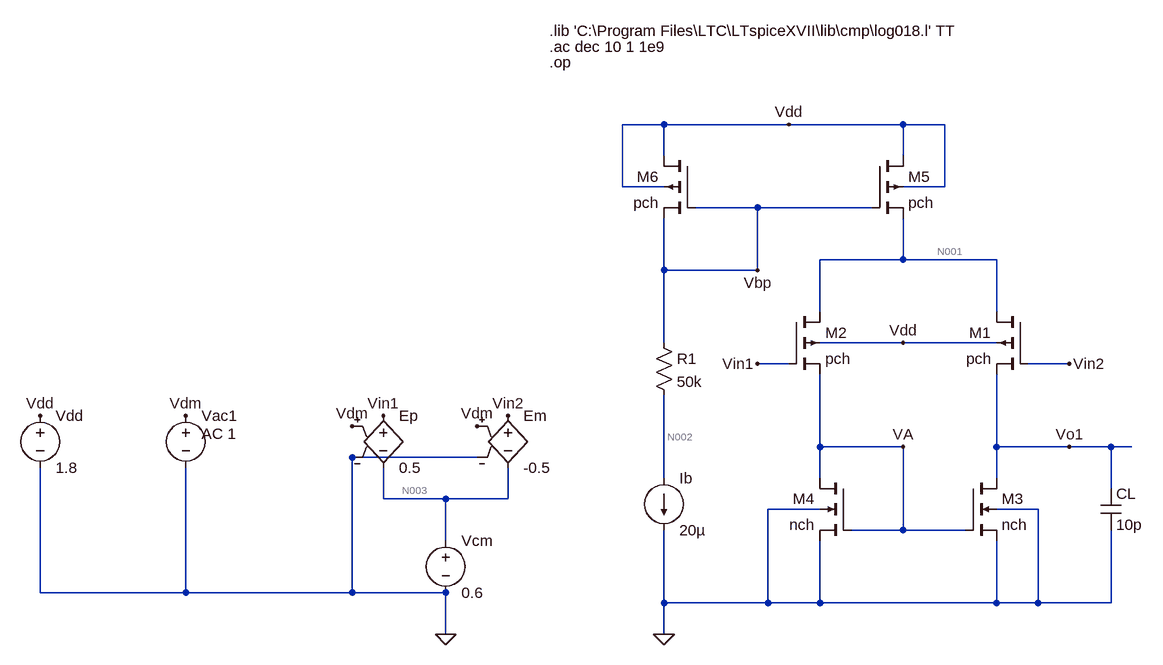
[diagram p0: schematic q2c.asc]
q2c.asc, the LTspice schematic file:
Version 4
SHEET 1 2116 680
WIRE 1312 -656 1248 -656
WIRE 1504 -656 1312 -656
WIRE 1680 -656 1504 -656
WIRE 1744 -656 1680 -656
WIRE 1312 -608 1312 -656
WIRE 1680 -608 1680 -656
WIRE 1248 -560 1248 -656
WIRE 1312 -560 1248 -560
WIRE 1744 -560 1744 -656
WIRE 1744 -560 1680 -560
WIRE 1456 -528 1360 -528
WIRE 1632 -528 1456 -528
WIRE 1680 -448 1680 -512
WIRE 1680 -448 1552 -448
WIRE 1824 -448 1680 -448
WIRE 1312 -432 1312 -512
WIRE 1456 -432 1456 -528
WIRE 1456 -432 1312 -432
WIRE 1552 -368 1552 -448
WIRE 1824 -368 1824 -448
WIRE 1312 -320 1312 -432
WIRE 1680 -320 1552 -320
WIRE 1824 -320 1680 -320
WIRE 1504 -288 1456 -288
WIRE 1936 -288 1872 -288
WIRE 1552 -160 1552 -272
WIRE 1680 -160 1552 -160
WIRE 1824 -160 1824 -272
WIRE 1936 -160 1824 -160
WIRE 2000 -160 1936 -160
WIRE 2032 -160 2000 -160
WIRE 1024 -144 832 -144
WIRE 1312 -112 1312 -240
WIRE 1552 -112 1552 -160
WIRE 1824 -112 1824 -160
WIRE 2000 -96 2000 -160
WIRE 880 -80 880 -128
WIRE 976 -80 880 -80
WIRE 1072 -80 1072 -128
WIRE 1072 -80 976 -80
WIRE 1552 -64 1472 -64
WIRE 1888 -64 1824 -64
WIRE 1680 -32 1680 -160
WIRE 1680 -32 1600 -32
WIRE 1776 -32 1680 -32
WIRE 976 -16 976 -80
WIRE 352 64 352 -128
WIRE 576 64 576 -128
WIRE 576 64 352 64
WIRE 832 64 832 -144
WIRE 832 64 576 64
WIRE 976 64 832 64
WIRE 1312 80 1312 -32
WIRE 1472 80 1472 -64
WIRE 1472 80 1312 80
WIRE 1552 80 1552 -16
WIRE 1552 80 1472 80
WIRE 1824 80 1824 -16
WIRE 1824 80 1552 80
WIRE 1888 80 1888 -64
WIRE 1888 80 1824 80
WIRE 2000 80 2000 -32
WIRE 2000 80 1888 80
WIRE 976 128 976 64
WIRE 1312 128 1312 80
FLAG 832 -192 Vdm
FLAG 1024 -192 Vdm
FLAG 976 128 0
FLAG 1504 -656 Vdd
FLAG 1680 -320 Vdd
FLAG 352 -208 Vdd
FLAG 576 -208 Vdm
FLAG 880 -208 Vin1
FLAG 1072 -208 Vin2
FLAG 1456 -288 Vin1
FLAG 1936 -288 Vin2
FLAG 1936 -160 Vo1
FLAG 1680 -160 VA
FLAG 1312 128 0
FLAG 1456 -432 Vbp
SYMBOL voltage 576 -224 R0
WINDOW 123 24 44 Left 2
WINDOW 39 0 0 Left 0
SYMATTR Value2 AC 1
SYMATTR InstName Vac1
SYMATTR Value ""
SYMBOL voltage 976 -32 R0
SYMATTR InstName Vcm
SYMATTR Value 0.6
SYMBOL e 880 -224 R0
SYMATTR InstName Ep
SYMATTR Value 0.5
SYMBOL e 1072 -224 R0
SYMATTR InstName Em
SYMATTR Value -0.5
SYMBOL voltage 352 -224 R0
SYMATTR InstName Vdd
SYMATTR Value 1.8
SYMBOL pmos4 1360 -608 M0
SYMATTR InstName M6
SYMATTR Value pch
SYMATTR Value2 l=200n w=6u
SYMBOL pmos4 1632 -608 R0
SYMATTR InstName M5
SYMATTR Value pch
SYMATTR Value2 l=200n w=12u
SYMBOL pmos4 1504 -368 R0
SYMATTR InstName M2
SYMATTR Value pch
SYMATTR Value2 l=1u w=24u
SYMBOL pmos4 1872 -368 M0
SYMATTR InstName M1
SYMATTR Value pch
SYMATTR Value2 l=1u w=24u
SYMBOL nmos4 1600 -112 M0
SYMATTR InstName M4
SYMATTR Value nch
SYMATTR Value2 l=200n w=3u
SYMBOL nmos4 1776 -112 R0
SYMATTR InstName M3
SYMATTR Value nch
SYMATTR Value2 l=200n w=3u
SYMBOL res 1296 -336 R0
SYMATTR InstName R1
SYMATTR Value 50k
SYMBOL current 1312 -112 R0
SYMATTR InstName Ib
SYMATTR Value 20µ
SYMBOL cap 1984 -96 R0
SYMATTR InstName CL
SYMATTR Value 10p
TEXT 1136 -800 Left 2 !.lib 'C:\\Program Files\\LTC\\LTspiceXVII\\lib\\cmp\\log018.l' TT
TEXT 1136 -776 Left 2 !.ac dec 10 1 1e9
TEXT 1136 -752 Left 2 !.op

The netlist it stands for:
* q2c.asc
Vac1 Vdm 0 AC 1
Vcm N003 0 0.6
Ep Vin1 N003 Vdm 0 0.5
Em Vin2 N003 Vdm 0 -0.5
Vdd Vdd 0 1.8
M6 Vdd Vbp Vbp Vdd pch l=200n w=6u
M5 Vdd Vbp N001 Vdd pch l=200n w=12u
M2 N001 Vin1 VA Vdd pch l=1u w=24u
M1 N001 Vin2 Vo1 Vdd pch l=1u w=24u
M4 VA VA 0 0 nch l=200n w=3u
M3 Vo1 VA 0 0 nch l=200n w=3u
R1 Vbp N002 50k
Ib N002 0 20µ
CL Vo1 0 10p
.model NMOS NMOS
.model PMOS PMOS
.lib standard.mos
.lib 'C:\Program Files\LTC\LTspiceXVII\lib\cmp\log018.l' TT
.ac dec 10 1 1e9
.op
.backanno
.end

* Results of the author's LTspice run, read from the files saved beside the schematic
* Operating Point, zero values left out:
*   V(n003) = 600 mV
*   V(vin1) = 600 mV
*   V(vin2) = 600 mV
*   V(vdd) = 1.8 V
*   V(vbp) = 1.206 V
*   V(n001) = 1.338 V
*   V(va) = 540.1 mV
*   V(vo1) = 540.1 mV
*   V(n002) = 206.5 mV
*   Id(M3) = 19.58 µA
*   Is(M3) = -19.58 µA
*   Id(M4) = 19.58 µA
*   Is(M4) = -19.58 µA
*   Id(M1) = 19.58 µA
*   Ib(M1) = 1.742 pA
*   Is(M1) = -19.58 µA
*   Id(M2) = 19.58 µA
*   Ib(M2) = 1.742 pA
*   Is(M2) = -19.58 µA
*   Id(M5) = 39.16 µA
*   Is(M5) = -39.16 µA
*   Id(M6) = 20 µA
*   Is(M6) = -20 µA
*   I(Ib) = 20 µA
*   I(R1) = 20 µA
*   I(Vdd) = -59.16 µA
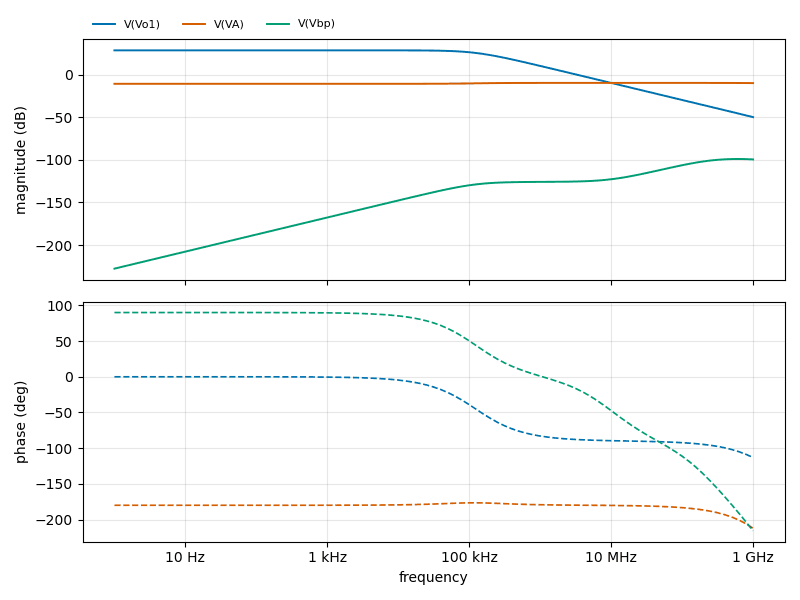
[diagram p1: AC Analysis of q2c.asc, plotted from the saved traces]
* AC Analysis, 1 run:
*   V(Vo1): 28.46 dB at 1 Hz, -49.84 dB at 1 GHz, peak 28.46 dB at 1 Hz, 3 dB below the peak at 122.7 kHz
*   V(VA): -10.77 dB at 1 Hz, -9.95 dB at 1 GHz, peak -9.72 dB at 12.59 MHz
*   V(Vbp): -227.60 dB at 1 Hz, -99.49 dB at 1 GHz, peak -98.96 dB at 631 MHz, 3 dB below the peak at 194.8 MHz
* From the log:
*   Semiconductor Device Operating Points:
*                           --- BSIM3 MOSFETS ---
*   Name:        m3          m4          m1          m2          m5
*   Model:      nch.6       nch.6       pch.2       pch.2       pch.3
*   Id:        1.96e-05    1.96e-05    1.96e-05    1.96e-05    3.92e-05
*   Vgs:       5.40e-01    5.40e-01    5.99e-02    5.99e-02   -1.32e-01
*   Vds:       5.40e-01    5.40e-01    7.98e-01    7.98e-01    4.62e-01
*   Vbs:       0.00e+00    0.00e+00    1.26e+00    1.26e+00    4.62e-01
*   Vth:       5.12e-01    5.12e-01   -5.92e-01   -5.92e-01   -4.94e-01
*   Vdsat:     7.93e-02    7.93e-02   -1.62e-01   -1.62e-01   -1.25e-01
*   Gm:        3.10e-04    3.10e-04    2.08e-04    2.08e-04    4.96e-04
*   Gds:       6.84e-06    6.84e-06    9.10e-07    9.10e-07    1.19e-05
*   Gmb        8.96e-05    8.96e-05    5.75e-05    5.75e-05    1.66e-04
*   Cbd:       0.00e+00    0.00e+00    0.00e+00    0.00e+00    0.00e+00
*   Cbs:       0.00e+00    0.00e+00    0.00e+00    0.00e+00    0.00e+00
*   Cgsov:     1.09e-15    1.09e-15    7.86e-15    7.86e-15    3.93e-15
*   Cgdov:     1.09e-15    1.09e-15    7.86e-15    7.86e-15    3.93e-15
*   Cgbov:     3.55e-17    3.55e-17    2.73e-16    2.73e-16    5.37e-17
*   dQgdVgb:   5.08e-15    5.08e-15    1.59e-13    1.59e-13    2.23e-14
*   dQgdVdb:  -1.09e-15   -1.09e-15   -7.86e-15   -7.86e-15   -3.90e-15
*   dQgdVsb:  -3.20e-15   -3.20e-15   -1.44e-13   -1.44e-13   -1.70e-14
*   dQddVgb:  -1.10e-15   -1.10e-15   -8.02e-15   -8.02e-15   -3.97e-15
*   dQddVdb:   1.09e-15    1.09e-15    7.91e-15    7.91e-15    3.94e-15
*   dQddVsb:   4.61e-18    4.61e-18    1.52e-16    1.52e-16    3.84e-17
*   dQbdVgb:  -9.05e-16   -9.05e-16   -2.20e-14   -2.20e-14   -3.15e-15
*   dQbdVdb:   5.30e-19    5.30e-19   -7.49e-18   -7.49e-18   -1.57e-19
*   dQbdVsb:  -4.74e-16   -4.74e-16   -1.74e-14   -1.74e-14   -2.04e-15
*   Name:        m6
*   Model:      pch.6
*   Id:        2.00e-05
*   Vgs:       0.00e+00
*   Vds:       5.94e-01
*   Vbs:       5.94e-01
*   Vth:      -4.93e-01
*   Vdsat:    -1.24e-01
*   Gm:        2.53e-04
*   Gds:       4.98e-06
*   Gmb        8.48e-05
*   Cbd:       0.00e+00
*   Cbs:       0.00e+00
*   Cgsov:     1.96e-15
*   Cgdov:     1.96e-15
*   Cgbov:     5.37e-17
*   dQgdVgb:   1.12e-14
*   dQgdVdb:  -1.94e-15
*   dQgdVsb:  -8.53e-15
*   dQddVgb:  -1.97e-15
*   dQddVdb:   1.96e-15
*   dQddVsb:   1.20e-17
*   dQbdVgb:  -1.61e-15
*   dQbdVdb:   1.23e-18
*   dQbdVsb:  -1.01e-15